# EAGLE design main (EAGLE 9.5.2)
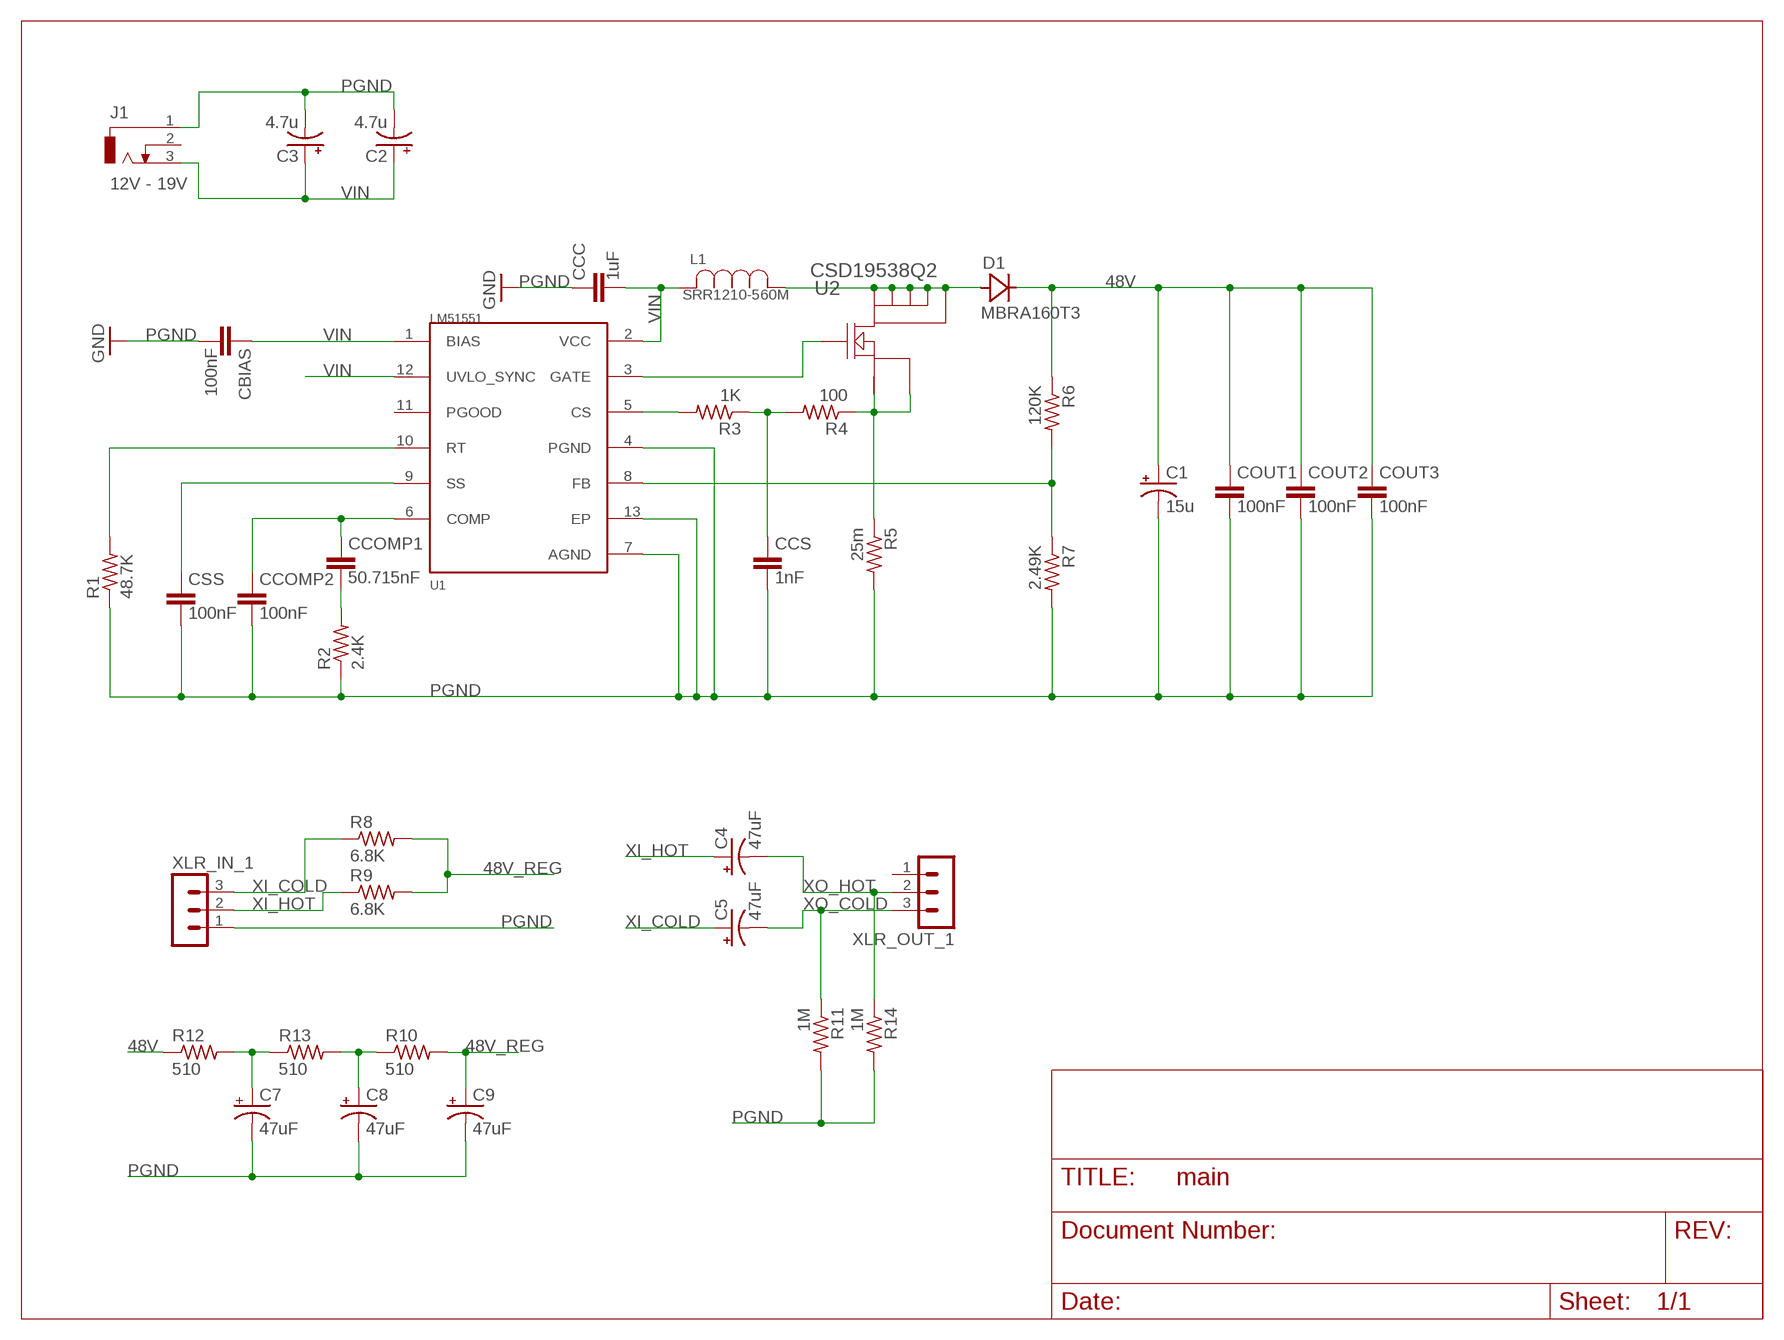
[diagram p0: schematic, sheet 1]

## Parts
C1  15u  CPOL-USCT7343  [CT7343]
C2  4.7u  CPOL-USCT7343  [CT7343]
C3  4.7u  CPOL-USCT7343  [CT7343]
C4  47uF  CPOL-US153CLV-0810  [153CLV-0810]
C5  47uF  CPOL-US153CLV-0810  [153CLV-0810]
C7  47uF  CPOL-US153CLV-0810  [153CLV-0810]
C8  47uF  CPOL-US153CLV-0810  [153CLV-0810]
C9  47uF  CPOL-US153CLV-0810  [153CLV-0810]
CBIAS  100nF  C-EUC0805  [C0805]
CCC  1uF  C-EUC0805  [C0805]
CCOMP1  50.715nF  C-EUC0805  [C0805]
CCOMP2  100nF  C-EUC0805  [C0805]
CCS  1nF  C-EUC0805  [C0805]
COUT1  100nF  C-EUC0805  [C0805]
COUT2  100nF  C-EUC0805  [C0805]
COUT3  100nF  C-EUC0805  [C0805]
CSS  100nF  C-EUC0805  [C0805]
D1  MBRA160T3  MBRA340T3  [SMA]
J1  12V - 19V  DCJ0303  [DCJ0303]
L1  SRR1210-560M  [IND_BOURNS_SRR1210]
R1  48.7K  R-US_R0805  [R0805]
R2  2.4K  R-US_R0805  [R0805]
R3  1K  R-US_R0805  [R0805]
R4  100  R-US_R0805  [R0805]
R5  25m  R-US_R1206  [R1206]
R6  120K  R-US_R0805  [R0805]
R7  2.49K  R-US_R0805  [R0805]
R8  6.8K  R-US_R1206  [R1206]
R9  6.8K  R-US_R1206  [R1206]
R10  510  R-US_R1206  [R1206]
R11  1M  R-US_R0805  [R0805]
R12  510  R-US_R1206  [R1206]
R13  510  R-US_R1206  [R1206]
R14  1M  R-US_R0805  [R0805]
U1  LM51551  [SON45P300X300X80-13N]
U2  CSD19538Q2  [DQK0006C]
XLR_IN_1  MA03-1  [MA03-1]
XLR_OUT_1  MA03-1  [MA03-1]

## Nets
48V: C1.+ COUT1.1 COUT2.1 COUT3.1 D1.C R6.1 R12.1
48V_REG: C9.+ R8.2 R9.2 R10.2
N$1: R1.2 U1.10(RT)
N$2: CSS.1 U1.9(SS)
N$4: CCOMP1.2 R2.2
N$5: CCOMP1.1 CCOMP2.1 U1.6(COMP)
N$6: R4.1 R5.1 U2.4(SOURCE_2) U2.7(SOURCE_1)
N$7: R3.2 U1.5(CS)
N$8: CCS.1 R3.1 R4.2
N$9: U1.3(GATE) U2.3(GATE)
N$11: D1.A L1.1 U2.1(DRAIN_1) U2.2(DRAIN_2) U2.5(DRAIN_3) U2.6(DRAIN_4) U2.8(DRAIN_5)
N$12: R6.2 R7.1 U1.8(FB)
N$15: C8.+ R10.1 R13.2
N$16: C7.+ R12.2 R13.1
PGND: C1.- C2.- C3.- C7.- C8.- C9.- CBIAS.2 CCC.1 CCOMP2.2 CCS.2 COUT1.2 COUT2.2 COUT3.2 CSS.2 J1.1 R1.1 R2.1 R5.2 R7.2 R11.2 R14.2 U1.4(PGND) U1.7(AGND) U1.13(EP) XLR_IN_1.1 ; supply symbol labelled GND
VIN: C2.+ C3.+ CBIAS.1 CCC.2 J1.3 L1.2 U1.1(BIAS) U1.2(VCC) U1.12(UVLO_SYNC)
XI_COLD: C5.+ R8.1 XLR_IN_1.3
XI_HOT: C4.+ R9.1 XLR_IN_1.2
XO_COLD: C5.- R11.1 XLR_OUT_1.3
XO_HOT: C4.- R14.1 XLR_OUT_1.2
Unconnected: J1.2 U1.11(PGOOD) XLR_OUT_1.1

## Library data of the parts
C1-C5 C7-C9 = rcl:CPOL-US: POLARIZED CAPACITOR, American symbol; SPICEPREFIX: C
CBIAS CCC CCOMP1 CCOMP2 CCS COUT1-COUT3 CSS = rcl:C-EU: CAPACITOR, European symbol; SPICEPREFIX: C
D1 = diode:MBRA340T3: Surface Mount Schottky Power Rectifier Source: http://www.onsemi.com/pub_link/Collateral/MBRA340T3-D.PDF
J1 = con-jack:DCJ0303: DC POWER JACK Source: DCJ0303.pdf; OC_FARNELL: unknown; OC_NEWARK: unknown
L1 = SON45P300X300X80-13N:SRR1210-560M; BUILT_BY: EMA_UL_Team; MANUFACTURER_PART_NUMBER: SRR1210-560M; VENDOR: Bourns Electronics
R1-R14 = rcl:R-US_: RESISTOR, American symbol; SPICEPREFIX: R
U1 = SON45P300X300X80-13N:LM51551
U2 = SON45P300X300X80-13N:CSD19538Q2; BUILT_BY: Texas_Instrument_Team; MANUFACTURER_PART_NUMBER: CSD19538Q2; VENDOR: Texas Instruments
XLR_IN_1 XLR_OUT_1 = con-lstb:MA03-1: PIN HEADER; OC_FARNELL: unknown; OC_NEWARK: unknown

## Board
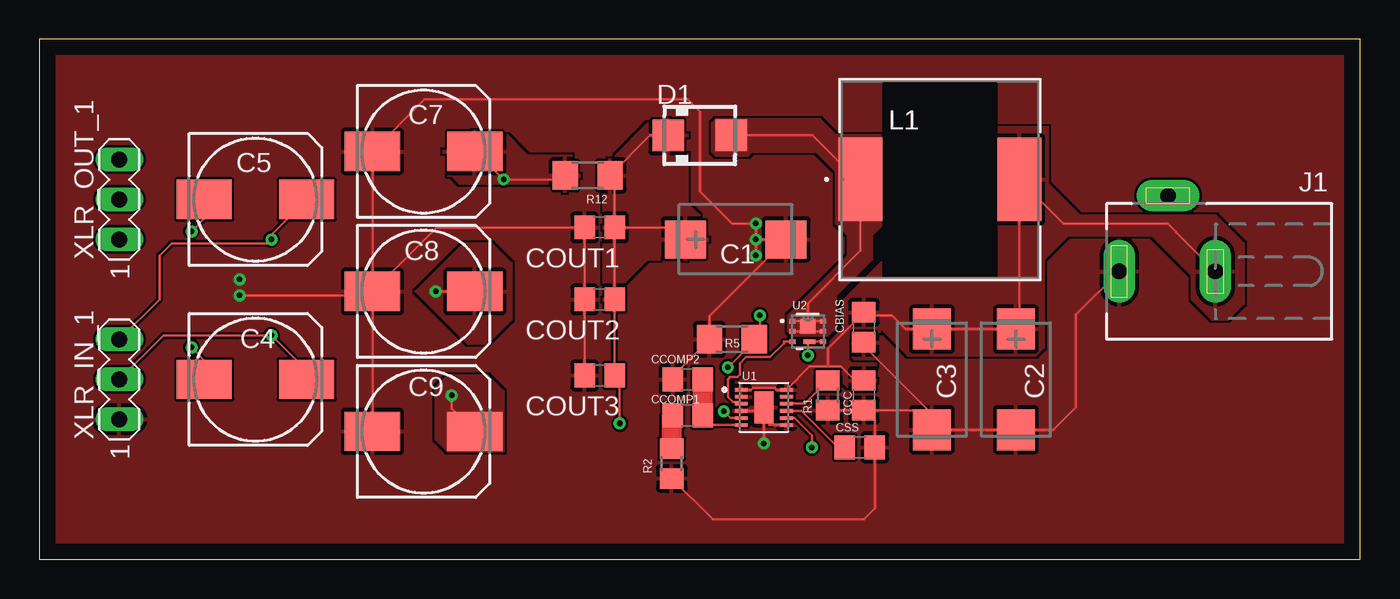
[diagram p1: board, top side]
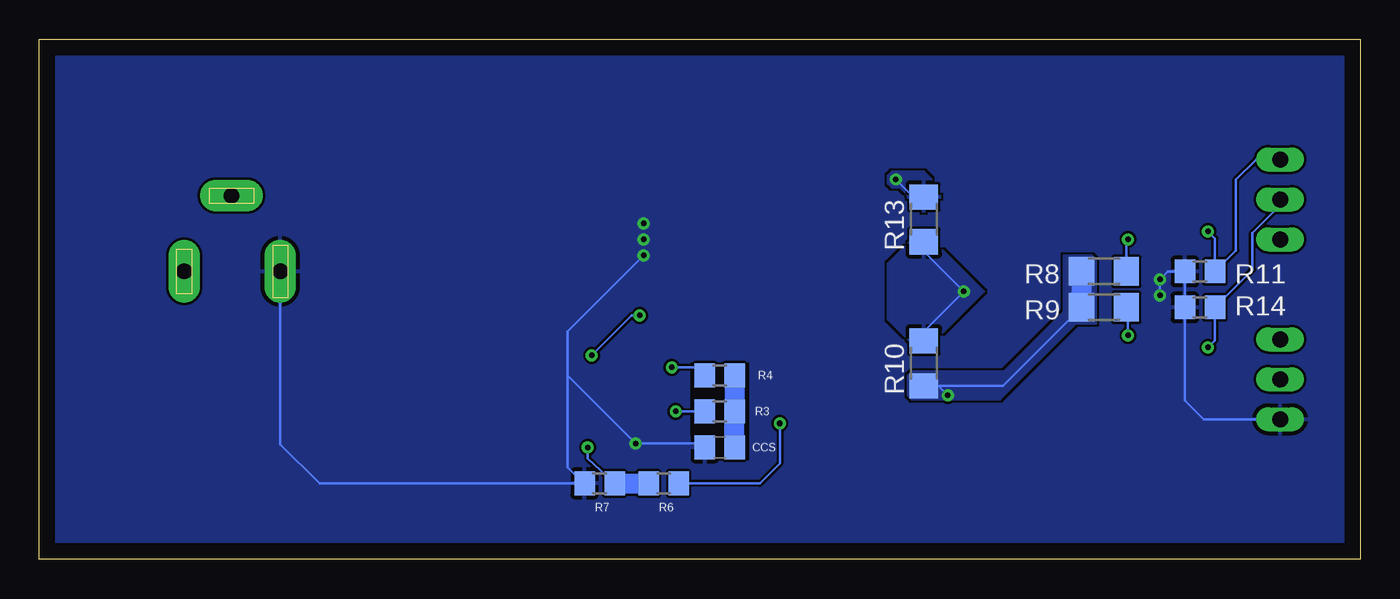
[diagram p2: board, bottom side, seen from below]

Size 83.82 x 33.02 mm. Coordinates in mm from the lower left corner, seen from the top.
Outline: 0,0 83.82,0 83.82,33.02 0,33.02 0,0
Copper layers (1*16): Top 0.035mm / dielectric 1.5mm / Bottom 0.035mm
Design rules "default": minimum track width 6mil, minimum drill 0.35mm, track to track 6mil, track to pad 6mil, pad to pad 6mil, via to via 6mil, smd to smd 6mil, copper to edge 40mil, drill to drill 6mil, minimum pad ring 10mil, minimum via ring 8mil, stop-mask expansion 4mil, vias tented up to drill 0mil, thermal gap 10mil

### Footprints (pad centres in the part's own frame; a part is rotated, then mirrored left to right if it is on the bottom)
CT7343 = smd 2.6 x 2.4: + -3.2,0; - 3.2,0
153CLV-0810 = smd 3.5 x 2.5: + 3.25,0; - -3.25,0
C0805 = smd 1.3 x 1.5: 1 -0.95,0; 2 0.95,0
SMA = smd 2 x 2: A 2,0; C -2,0
DCJ0303 = drill 1 pad 2 long: 1 0,3.1; 2 4.8,0; 3 0,-3
IND_BOURNS_SRR1210 = smd 2.794 x 5.309: 1 -5.042,0; 2 5.042,0
R0805 = smd 1.3 x 1.5: 1 -0.95,0; 2 0.95,0
R1206 = smd 1.6 x 1.803: 1 -1.422,0; 2 1.422,0
SON45P300X300X80-13N = smd 0.86 x 0.22: 1 -1.435,1.125; 2 -1.435,0.675; 3 -1.435,0.225; 4 -1.435,-0.225; 5 -1.435,-0.675; 6 -1.435,-1.125; 7 1.435,-1.125; 8 1.435,-0.675; 9 1.435,-0.225; 10 1.435,0.225; 11 1.435,0.675; 12 1.435,1.125 | smd 1.21 x 2.02: 13 0,0
DQK0006C = smd 0.457 x 0.305: 1 -0.975,0.65; 2 -0.975,0; 3 -0.975,-0.65; 4 0.975,-0.65; 5 0.975,0; 6 0.975,0.65 | smd 0.762 x 0.305: 7 0.095,-0.65 | smd 0.991 x 0.94: 8 0,0.325
MA03-1 = drill 1.016 long: 1 -2.54,0; 2 0,0; 3 2.54,0

### Placement (x,y rotation side)
C1  44.2,20.32 0 top
C2  61.98,11.43 270 top
C3  56.64,11.43 270 top
C4  13.72,11.43 0 top
C5  13.72,22.86 0 top
C7  24.38,25.91 0 top
C8  24.38,17.02 0 top
C9  24.38,8.13 0 top
CBIAS  52.32,14.73 270 top
CCC  52.32,10.41 90 top
CCOMP1  41.15,9.14 180 top
CCOMP2  41.15,11.43 180 top
CCS  40.64,7.11 180 bottom
COUT1  35.56,21.08 180 top
COUT2  35.56,16.51 180 top
COUT3  35.56,11.68 180 top
CSS  52.07,7.11 0 top
D1  41.91,26.92 0 top
J1  71.63,18.29 90 top
L1  57.15,24.13 0 top
R1  50.04,10.41 90 top
R2  40.13,6.1 90 top
R3  40.64,9.4 180 bottom
R4  40.64,11.68 0 bottom
R5  43.94,13.97 180 top
R6  44.2,4.83 180 bottom
R7  48.26,4.83 180 bottom
R8  16.26,18.29 180 bottom
R9  16.26,16 180 bottom
R10  27.69,12.45 270 bottom
R11  10.16,18.29 180 bottom
R12  34.8,24.38 180 top
R13  27.69,21.59 270 bottom
R14  10.16,16 180 bottom
U1  45.97,9.65 0 top
U2  48.77,14.48 0 top
XLR_IN_1  5.08,11.43 90 top
XLR_OUT_1  5.08,22.86 90 top

### Tracks (layer width: path | path; a pad name or v marks a point on that pad's centre or on a via)
48V  (via drill 0.35)
  Top 0.152: COUT1.1 COUT2.1 COUT3.1 36.83,11.36 v36.83,8.64 | COUT1.1 36.51,24.09 R12.1 38.76,26.92 D1.C | COUT1.1 40.23,21.08 C1.+
  Bottom 0.152: v36.83,8.64 36.83,6.1 38.1,4.83 R6.1
  pour Top: 35.81,16.26 36.32,15.75 36.83,15.75 37.08,16 37.08,17.53 38.61,19.05 42.16,19.05 42.42,19.3 42.42,21.34 41.15,22.61 41.15,27.69 40.89,27.94 38.86,27.94 36.32,25.4 35.81,25.4 35.56,25.15 35.56,23.37 35.81,23.11
48V_REG  (via drill 0.35)
  Top 0.152: C9.+ 26.16,9.6 v26.16,10.41
  Bottom 0.152: R9.2 22.66,11.02 R10.2 26.77,11.02 v26.16,10.41
  Bottom 1.27: R8.2 R9.2
  pour Top (no thermals): 25.91,6.86 25.15,7.62 25.15,10.92 25.91,11.68 28.45,11.68 29.46,10.67 29.46,6.86
  pour Bottom (no thermals): 28.7,11.68 28.45,11.94 22.61,11.94 18.8,15.75 18.8,19.3 17.02,19.3 16.76,19.05 16.76,14.99 18.03,14.99 22.86,10.16 28.45,10.16 28.7,10.41
N$1
  Top 0.152: R1.2 48.58,9.91 47.44,9.91 U1.10
N$2
  Top 0.152: U1.9 48.35,9.43 50.67,7.11 CSS.1
N$4
  Top 0.152: CCOMP1.2 40.13,9.08
  Top 1.27: 40.13,9.08 R2.2
N$5
  Top 0.152: U1.6 42.72,8.53 CCOMP1.1
  Top 1.27: CCOMP2.1 CCOMP1.1
N$6  (via drill 0.35)
  Top 0.152: v43.69,12.19 45.36,13.87 R5.1 45.72,14.33 v45.72,15.49 | v48.77,12.95 48.77,13.73 U2.7 U2.4
  Bottom 0.152: R4.1 42.1,12.19 v43.69,12.19 | v45.72,15.49 46.23,15.49 v48.77,12.95
N$7  (via drill 0.35)
  Top 0.152: U1.5 43.85,8.98 v43.43,9.4
  Bottom 0.152: v43.43,9.4 R3.2
N$8
  Bottom 1.27: CCS.1 R3.1 R4.2
N$9
  Top 0.152: U1.3 44.43,9.99 44.03,9.99 43.69,10.33 43.69,11.43 43.84,11.59 44.3,11.59 44.45,11.74 44.45,12.45 44.84,12.84 46.37,12.84 47.25,13.72 47.25,13.83 U2.3
N$11
  Top 0.152: L1.1 52.11,23.88 | 52.11,23.88 52.11,19.6 48.77,16.26 U2.8 | D1.A 49.06,26.92 52.11,23.88 | U2.1 48.44,15.13 U2.8 | U2.5 49.09,14.48 48.8,14.77 | 48.8,14.77 U2.8 | U2.6 49.09,15.13 U2.8 | U2.2 48.51,14.48 48.8,14.77
  pour Top (no thermals): 42.93,27.94 42.67,27.69 42.67,25.91 42.93,25.65 44.96,25.65 45.21,25.91 49.28,25.91 50.55,24.64 50.55,21.34 51.31,20.57 51.31,19.3 47.5,15.49 47.5,14.48 47.75,14.22 50.04,14.22 50.55,14.73 50.55,16.76 52.83,19.05 52.83,20.57 53.59,21.34 53.59,26.67 53.34,26.92 50.55,26.92 49.53,27.94
N$12  (via drill 0.35)
  Top 0.152: U1.8 47.92,8.98 49.02,7.87 v49.02,7.11
  Bottom 0.152: v49.02,7.11 49.02,6.42 R7.1
  Bottom 1.27: R7.1 R6.2
N$15  (via drill 0.35)
  Top 0.152: C8.+ v25.15,17.02
  Bottom 0.152: R13.2 27.69,19.56 v25.15,17.02 27.69,14.48 R10.1
  pour Top: 23.88,17.02 26.92,20.07 27.69,20.07 28.7,20.07 29.97,18.8 29.97,15.24 28.45,13.72 27.69,13.72 27.18,13.72
  pour Bottom: 23.88,17.02 27.18,20.32 28.45,20.32 29.97,18.8 29.97,15.24 28.45,13.72 27.18,13.72
N$16  (via drill 0.35)
  Top 0.152: C7.+ 27.69,25.91 v29.46,24.13 33.12,24.13 R12.2
  Bottom 0.152: v29.46,24.13 28.35,23.01 R13.1
  pour Top: 34.29,25.15 33.78,25.65 31.5,25.65 30.99,25.65 29.46,27.18 25.91,27.18 25.65,26.92 25.65,24.64 25.91,24.38 26.16,24.38 26.67,23.88 32.26,23.88 32.51,23.62 32.77,23.37 34.04,23.37 34.29,23.62
  pour Bottom: 26.67,23.62 27.69,24.64 29.72,24.64 29.97,24.38 29.97,23.88 29.72,23.62 29.21,23.62 28.7,23.11 28.7,22.35 28.45,22.1 26.92,22.1 26.67,22.35
PGND  (via drill 0.35)
  Top 0.152: J1.1 65.79,15.55 65.79,9.65 64.36,8.23 C2.- C3.- | C3.- 55.41,9.46 CCC.1 | U1.7 46.34,8.53 45.97,8.89 | 45.97,8.89 45.44,9.43 U1.4 45.75,9.43 U1.13 45.97,8.89 | CCOMP2.2 40.2,11.65 R5.2 42.52,15.44 47.32,20.24 | 47.32,20.24 C1.- | CBIAS.2 52.32,13.56 56.64,9.25 C3.- | v12.7,16.76 20.88,16.76 C8.- | C8.- C9.- | C8.- C7.- 24.44,29.21 41.15,29.21 41.92,28.44 41.92,23.36 43.94,21.34 v45.47,21.34 v45.47,20.32 | CCC.1 53.02,8.77 CSS.2 53.02,3.24 52.32,2.54 42.74,2.54 R2.1 | 45.97,8.89 v45.97,7.37 | COUT3.2 COUT2.2 COUT1.2 25.2,21.08 C8.- | v45.47,19.3 v45.47,20.32 | v45.47,20.32 47.24,20.32 47.32,20.24 | R1.1 CCC.1
  Bottom 0.152: XLR_IN_1.1 9.91,8.89 11.11,10.09 R14.2 R11.2 12.19,18.29 v12.7,17.78 v12.7,16.76 | 49.28,4.83 66.04,4.83 68.53,7.31 J1.1 | 50.29,11.68 50.29,14.48 v45.47,19.3 | 50.29,11.68 v45.97,7.37 41.84,7.37 CCS.2 | 50.29,11.68 50.29,5.84 49.28,4.83 | R7.2 49.28,4.83
  pour Top (rank 2): 0,33.02 83.82,33.02 83.82,0 0.25,0 0,0
  pour Bottom (rank 2): 0,33.02 83.82,33.02 83.82,0 0,0
  cutout Bottom: 38.86,12.45 38.86,6.35 40.89,6.35 40.89,7.87 42.42,7.87 42.42,12.45
VIN
  Top 0.152: J1.3 72.14,20.78 72.14,20.83 71.63,21.34 64.99,21.34 L1.2 62.19,14.85 C2.+ C3.+ 54.97,14.63 54.1,15.49 52.51,15.49 CBIAS.1 50.04,13.4 50.04,12.24 | CCC.2 51.76,11.36 50.88,12.24 50.04,12.24 | 50.04,12.24 48.88,12.24 U1.12 46.79,10.78 46.67,10.89 45.27,10.89 45.16,10.78 U1.1
  pour Top: 51.05,14.73 53.34,14.73 55.12,12.95 63.25,12.95 63.75,13.46 63.75,19.05 65.28,20.57 70.61,20.57 73.15,18.03 73.15,16.51 74.42,15.24 75.44,15.24 76.45,16.26 76.45,20.07 74.68,21.84 66.04,21.84 64.01,23.88 64.01,27.43 60.42,27.43 53.59,20.6 53.59,19.05 51.05,16.51
  pour Top: 44.2,10.67 44.2,11.43 44.7,11.94 44.7,12.45 45.21,12.95 46.74,12.95 47.24,13.46 49.78,13.46 51.05,14.73 51.05,16.26 51.56,16.76 53.34,16.76 53.34,14.48 53.09,14.22 51.56,14.22 51.31,13.97 51.31,12.7 51.56,12.45 53.09,12.45 53.09,10.92 51.31,10.92 51.05,11.18 51.05,11.68 50.8,11.94 49.28,11.94 49.02,11.68 49.02,10.67 48.51,10.16 44.7,10.16
XI_COLD  (via drill 0.35)
  Top 0.152: C5.+ 14.73,20.63 v14.73,20.32 14.48,20.07 8.38,20.07 7.62,19.3 7.62,16.51 XLR_IN_1.3
  Bottom 0.152: R8.1 14.83,20.22 v14.73,20.32
XI_HOT  (via drill 0.35)
  Top 0.152: C4.+ 16.97,11.99 v14.73,14.22 7.87,14.22 XLR_IN_1.2
  Bottom 0.152: v14.73,14.22 14.73,15.9 R9.1
XO_COLD  (via drill 0.35)
  Top 0.152: v9.65,20.83 10.47,21.64 C5.-
  Bottom 0.152: XLR_OUT_1.3 6.6,25.4 7.87,24.13 7.87,19.62 R11.1 9.21,20.39 v9.65,20.83
XO_HOT  (via drill 0.35)
  Top 0.152: v9.65,13.46 10.47,12.65 C4.-
  Bottom 0.152: XLR_OUT_1.2 5.08,22.48 6.83,20.73 6.83,18.38 R14.1 9.21,13.9 v9.65,13.46